# EAGLE design GB-Cartridge-Reader-Writer (EAGLE 9.5.2)
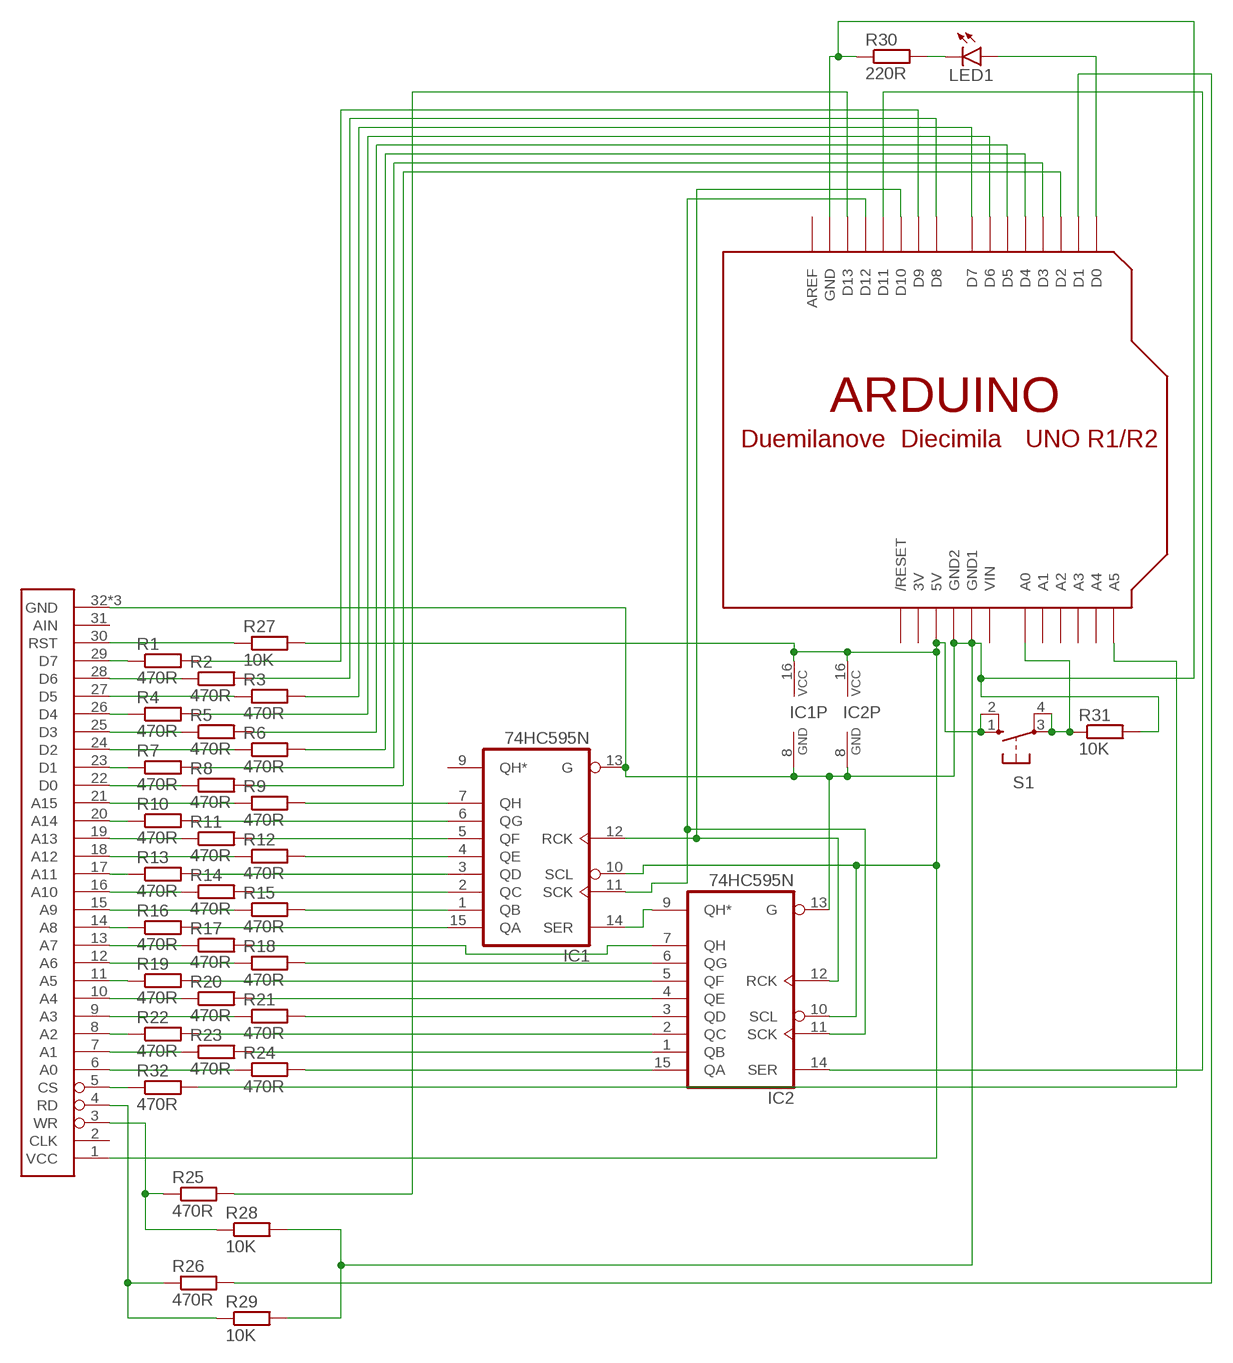
[diagram p0: schematic, sheet 1]

## Parts
IC1  74HC595N  [DIL16]
IC2  74HC595N  [DIL16]
LED1  LED5MM  [LED5MM]
R1  470R  R-EU_0207/10  [0207/10]
R2  470R  R-EU_0207/10  [0207/10]
R3  470R  R-EU_0207/10  [0207/10]
R4  470R  R-EU_0207/10  [0207/10]
R5  470R  R-EU_0207/10  [0207/10]
R6  470R  R-EU_0207/10  [0207/10]
R7  470R  R-EU_0207/10  [0207/10]
R8  470R  R-EU_0207/10  [0207/10]
R9  470R  R-EU_0207/10  [0207/10]
R10  470R  R-EU_0207/10  [0207/10]
R11  470R  R-EU_0207/10  [0207/10]
R12  470R  R-EU_0207/10  [0207/10]
R13  470R  R-EU_0207/10  [0207/10]
R14  470R  R-EU_0207/10  [0207/10]
R15  470R  R-EU_0207/10  [0207/10]
R16  470R  R-EU_0207/10  [0207/10]
R17  470R  R-EU_0207/10  [0207/10]
R18  470R  R-EU_0207/10  [0207/10]
R19  470R  R-EU_0207/10  [0207/10]
R20  470R  R-EU_0207/10  [0207/10]
R21  470R  R-EU_0207/10  [0207/10]
R22  470R  R-EU_0207/10  [0207/10]
R23  470R  R-EU_0207/10  [0207/10]
R24  470R  R-EU_0207/10  [0207/10]
R25  470R  R-EU_0207/10  [0207/10]
R26  470R  R-EU_0207/10  [0207/10]
R27  10K  R-EU_0207/10  [0207/10]
R28  10K  R-EU_0207/10  [0207/10]
R29  10K  R-EU_0207/10  [0207/10]
R30  220R  R-EU_0207/10  [0207/10]
R31  10K  R-EU_0207/10  [0207/10]
R32  470R  R-EU_0207/10  [0207/10]
S1  10-XX  [B3F-10XX]
U$1  ARDUINO-NOHOLE  [ARDUINO-NOHOLE]
U$2  GB-CARTRIDGE-SLOTV3  [GB-CARTRIDGE-SLOT-3]

## Nets
N$1: R1.1 U$2.29(D7)
N$2: R2.1 U$2.28(D6)
N$3: R3.1 U$2.27(D5)
N$4: R4.1 U$2.26(D4)
N$5: R5.1 U$2.25(D3)
N$6: R6.1 U$2.24(D2)
N$7: R7.1 U$2.23(D1)
N$8: R8.1 U$2.22(D0)
N$9: R9.1 U$2.21(A15)
N$10: R10.1 U$2.20(A14)
N$11: R11.1 U$2.19(A13)
N$12: R12.1 U$2.18(A12)
N$13: R13.1 U$2.17(A11)
N$14: R14.1 U$2.16(A10)
N$15: R15.1 U$2.15(A9)
N$16: R16.1 U$2.14(A8)
N$17: R17.1 U$2.13(A7)
N$18: R18.1 U$2.12(A6)
N$19: R19.1 U$2.11(A5)
N$20: R20.1 U$2.10(A4)
N$21: R21.1 U$2.9(A3)
N$22: R22.1 U$2.8(A2)
N$23: R23.1 U$2.7(A1)
N$24: R24.1 U$2.6(A0)
N$25: IC2.15(QA) R24.2
N$26: IC2.1(QB) R23.2
N$27: R32.1 U$2.5(CS)
N$28: IC2.3(QD) R21.2
N$29: IC2.4(QE) R20.2
N$30: IC2.2(QC) R22.2
N$31: IC2.6(QG) R18.2
N$32: IC2.7(QH) R17.2
N$33: IC2.5(QF) R19.2
N$34: IC1.1(QB) R15.2
N$35: IC1.2(QC) R14.2
N$36: IC1.15(QA) R16.2
N$37: IC1.4(QE) R12.2
N$38: IC1.5(QF) R11.2
N$39: IC1.3(QD) R13.2
N$40: IC1.7(QH) R9.2
N$41: R1.2 U$1.D9
N$42: IC1.11(SCK) IC2.11(SCK) U$1.D12
N$43: R27.1 U$2.30(RST)
N$44: R25.1 R28.1 U$2.3(WR)
N$45: R5.2 U$1.D5
N$46: R26.2 U$1.D1
N$47: R7.2 U$1.D3
N$48: R8.2 U$1.D2
N$49: IC1.14(SER) IC2.9(QH*)
N$50: LED1.A U$1.D0
N$51: IC1.10(SCL) IC1.16(VCC) IC2.10(SCL) IC2.16(VCC) R27.2 S1.1(S) S1.2(S1) U$1.5V U$2.1(VCC)
N$52: R6.2 U$1.D4
N$54: R25.2 U$1.D13
N$55: R4.2 U$1.D6
N$56: R3.2 U$1.D7
N$57: R2.2 U$1.D8
N$58: LED1.K(C) R30.2
N$59: IC1.12(RCK) IC2.12(RCK) U$1.D10
N$60: IC1.6(QG) R10.2
N$61: IC2.14(SER) U$1.D11
N$62: IC1.8(GND) IC1.13(G) IC2.8(GND) IC2.13(G) R28.2 R29.2 R30.1 R31.2 U$1.GND U$1.GND1 U$1.GND2 U$2.32(GND) U$2.PAD1(GND) U$2.PAD2(GND)
N$63: R26.1 R29.1 U$2.4(RD)
N$64: R32.2 U$1.A5
N$65: R31.1 S1.3(P) S1.4(P1) U$1.A0
Unconnected: IC1.9(QH*) U$1.A1 U$1.A2 U$1.A3 U$1.A4 U$1.AREF U$1.RESET(/RESET) U$2.2(CLK) U$2.31(AIN)

## Power pins joined to a net without a drawn wire
3V: U$1.3V
VIN: U$1.VIN

## Library data of the parts
IC1 IC2 = 74xx:74*595: 8-bit SHIFT REGISTER, output latch
LED1 = led:LED: LED OSRAM: - CHIPLED LG R971, LG N971, LY N971, LG Q971, LY Q971, LO R971, LY R971 LH N974, LH R974 LS Q976, LO Q976, LY Q976 LO Q996 - Hyper CHIPLED LW Q18S LB Q993, LB Q99A, LB R99A - SideLED LS A670, LO A670, LY A670, LG A670, LP A670 LB A673, LV A673, LT A673, LW A673 LH A674 LY A675 LS A676, LA A676, LO A676, LY A676, LW A676 LS A679, LY A679, LG A679 - Hyper Micro SIDELED® LS Y876, LA Y876, LO Y876, LY Y876 LT Y87S - SmartLED LW L88C, LW L88S LB L89C, LB L89S, LG L890 LS L89K, LO L89K, LY L89K LS L896, LA L896, LO L896, LY L896 - TOPLED LS T670, LO T670, LY T670, LG T670, LP T670 LSG T670, LSP T670, LSY T670, LOP T670, LYG T670 LG T671, LOG T671, LSG T671 LB T673, LV T673, LT T673, LW T673 LH T674 LS T676, LA T676, LO T676, LY T676, LB T676, LH T676, LSB T676, LW T676 LB T67C, LV T67C, LT T67C, LS T67K, LO T67K, LY T67K, LW E67C LS E67B, LA E67B, LO E67B, LY E67B, LB E67C, LV E67C, LT E67C LW T67C LS T679, LY T679, LG T679 LS T770, LO T770, LY T770, LG T770, LP T770 LB T773, LV T773, LT T773, LW T773 LH T774 LS E675, LA E675, LY E675, LS T675 LS T776, LA T776, LO T776, LY T776, LB T776 LHGB T686 LT T68C, LB T68C - Hyper Mini TOPLED® LB M676 - Mini TOPLED Santana® LG M470 LS M47K, LO M47K, LY M47K Source: http://www.osram.convergy.de LUXEON: - LUMILED® LXK2-PW12-R00, LXK2-PW12-S00, LXK2-PW14-U00, LXK2-PW14-V00 LXK2-PM12-R00, LXK2-PM12-S00, LXK2-PM14-U00 LXK2-PE12-Q00, LXK2-PE12-R00, LXK2-PE12-S00, LXK2-PE14-T00, LXK2-PE14-U00 LXK2-PB12-K00, LXK2-PB12-L00, LXK2-PB12-M00, LXK2-PB14-N00, LXK2-PB14-P00, LXK2-PB14-Q00 LXK2-PR12-L00, LXK2-PR12-M00, LXK2-PR14-Q00, LXK2-PR14-R00 LXK2-PD12-Q00, LXK2-PD12-R00, LXK2-PD12-S00 LXK2-PH12-R00, LXK2-PH12-S00 LXK2-PL12-P00, LXK2-PL12-Q00, LXK2-PL12-R00 Source: www.luxeon.com KINGBRIGHT: KA-3528ASYC Source: www.kingbright.com
R1-R32 = rcl:R-EU_: RESISTOR, European symbol; SPICEPREFIX: R
S1 = switch-omron:10-XX: OMRON SWITCH; MPN: B3F-1000; OC_FARNELL: 176432; OC_NEWARK: 36M3542
U$1 = adafruit:ARDUINO: Arduino Diecimila/Duemilanove Make a shield with ease, this package has all the named pins as well as the two mounting drill holes and an outline of the USB and DC power connector. The outline is on the DIMENSION layer, so if your board house uses it they will cut the outline to match. http://www.ladyada.net/library/pcb/eaglelibrary.html
U$2 = jrodrigo-gameboy:GB-CARTRIDGE-SLOT

## Board
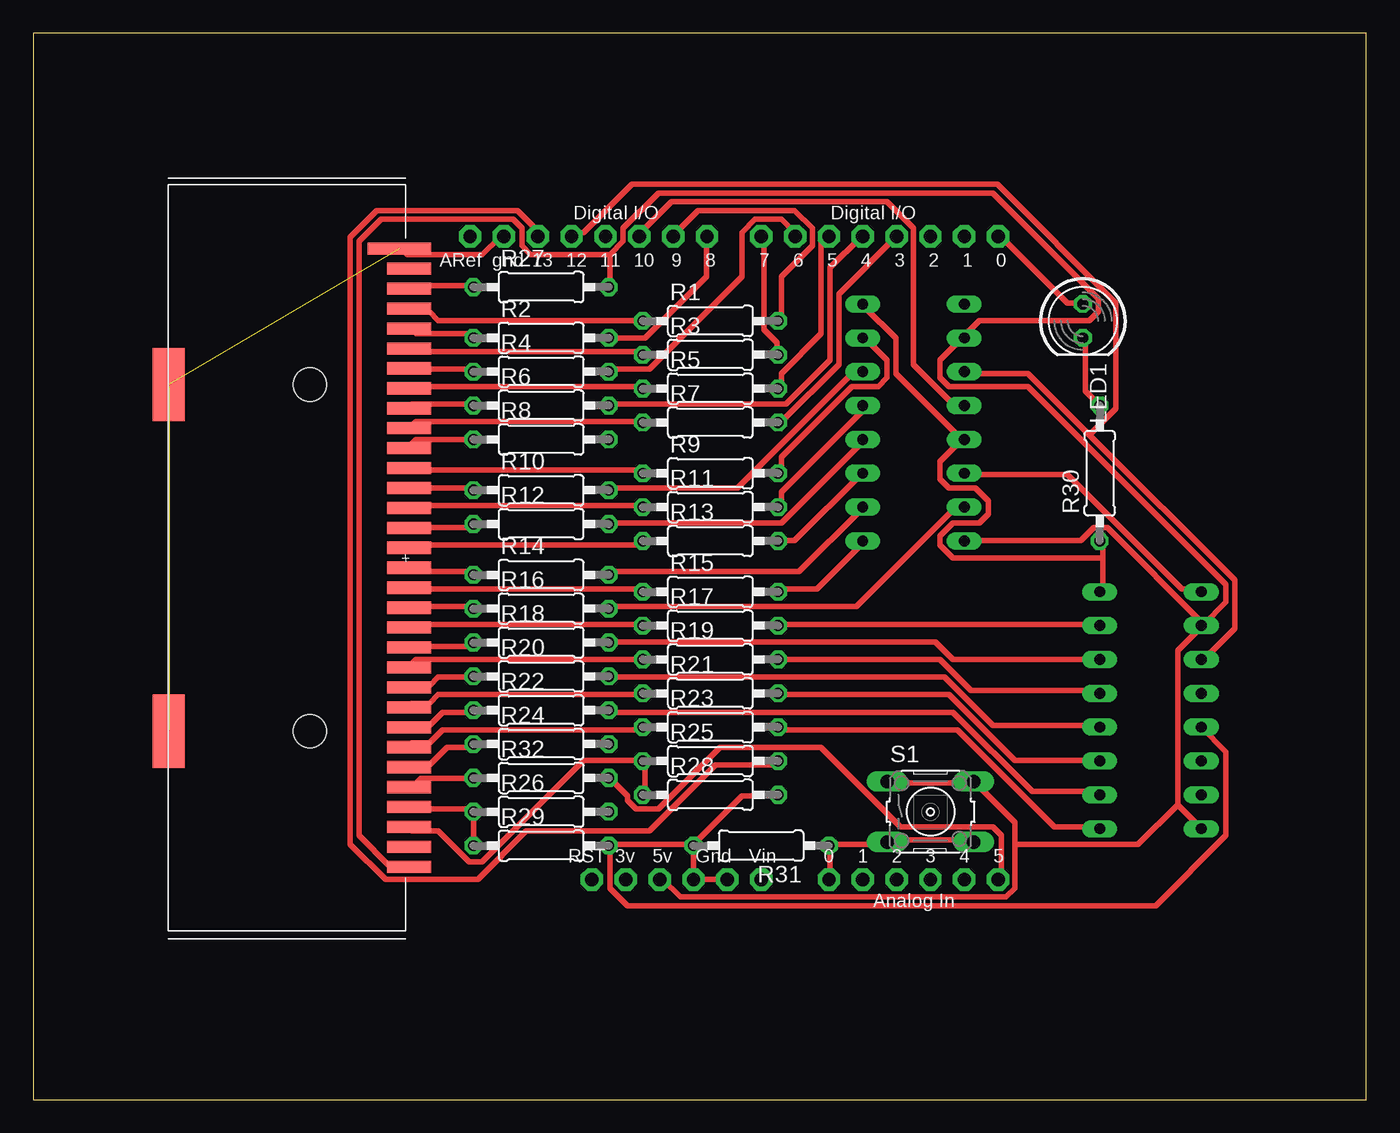
[diagram p1: board, top side]
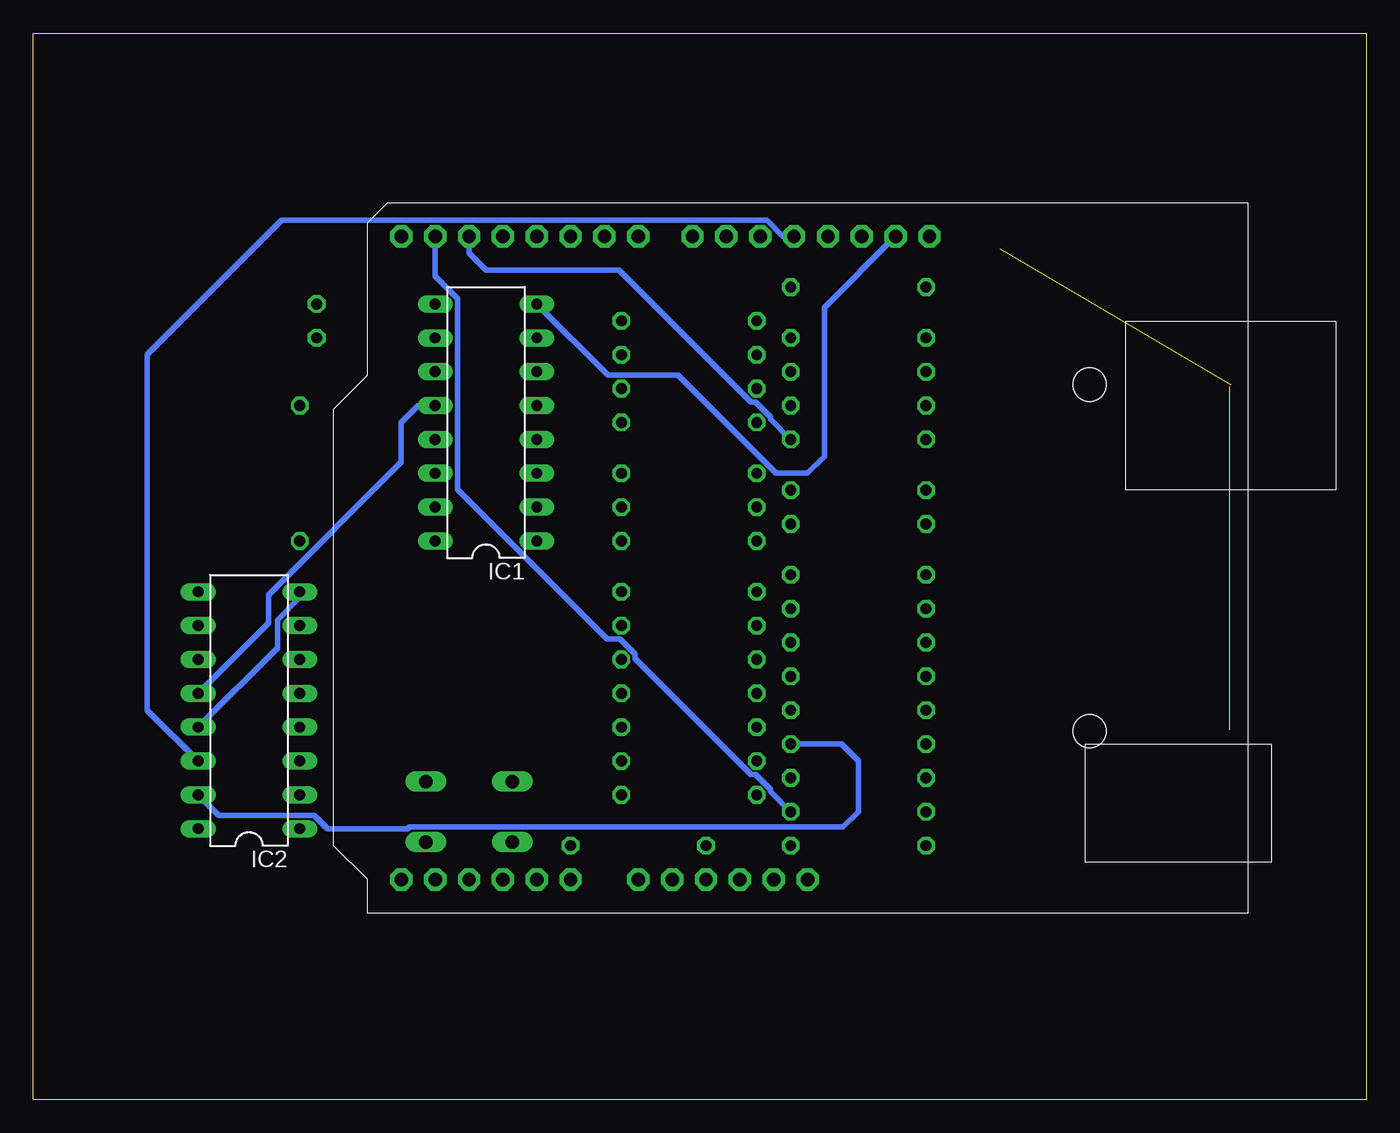
[diagram p2: board, bottom side, seen from below]

Size 100 x 80 mm. Coordinates in mm from the lower left corner, seen from the top.
Outline: 0,0 100,0 100,80 0,80 0,0
Copper layers (1*16): Top 0.035mm / dielectric 1.5mm / Bottom 0.035mm
Design rules "default *": minimum track width 16mil, minimum drill 0.7mm, track to track 10mil, track to pad 6mil, pad to pad 6mil, via to via 6mil, smd to smd 6mil, copper to edge 40mil, drill to drill 6mil, minimum pad ring 10mil, minimum via ring 8mil, stop-mask expansion 4mil, vias tented up to drill 0mil, thermal gap 10mil

### Footprints (pad centres in the part's own frame; a part is rotated, then mirrored left to right if it is on the bottom)
DIL16 = drill 0.813 long: 1 -8.89,-3.81; 2 -6.35,-3.81; 3 -3.81,-3.81; 4 -1.27,-3.81; 5 1.27,-3.81; 6 3.81,-3.81; 7 6.35,-3.81; 8 8.89,-3.81; 9 8.89,3.81; 10 6.35,3.81; 11 3.81,3.81; 12 1.27,3.81; 13 -1.27,3.81; 14 -3.81,3.81; 15 -6.35,3.81; 16 -8.89,3.81
LED5MM = drill 0.813 octagon: A -1.27,0; K 1.27,0
0207/10 = drill 0.813 octagon: 1 -5.08,0; 2 5.08,0
B3F-10XX = drill 1.016 long: 1 -3.251,2.261; 2 3.251,2.261; 3 -3.251,-2.261; 4 3.251,-2.261
ARDUINO-NOHOLE = drill 1 pad 1.676 octagon: 3V 35.56,2.54; 5V 38.1,2.54; A0 50.8,2.54; A1 53.34,2.54; A2 55.88,2.54; A3 58.42,2.54; A4 60.96,2.54; A5 63.5,2.54; AREF 23.876,50.8; D0 63.5,50.8; D1 60.96,50.8; D2 58.42,50.8; D3 55.88,50.8; D4 53.34,50.8; D5 50.8,50.8; D6 48.26,50.8; D7 45.72,50.8; D8 41.656,50.8; D9 39.116,50.8; D10 36.576,50.8; D11 34.036,50.8; D12 31.496,50.8; D13 28.956,50.8; GND 26.416,50.8; GND1 43.18,2.54; GND2 40.64,2.54; RESET 33.02,2.54; VIN 45.72,2.54
GB-CARTRIDGE-SLOT-3 = smd 3.302 x 0.914: 1 -0.27,23.183; 2 -0.27,21.687; 3 -0.27,20.191; 4 -0.27,18.695; 5 -0.27,17.199; 6 -0.27,15.703; 7 -0.27,14.207; 8 -0.27,12.71; 9 -0.27,11.214; 10 -0.27,9.718; 11 -0.27,8.222; 12 -0.27,6.726; 13 -0.27,5.23; 14 -0.27,3.734; 15 -0.27,2.238; 16 -0.27,0.742; 17 -0.27,-0.754; 18 -0.27,-2.25; 19 -0.27,-3.746; 20 -0.27,-5.242; 21 -0.27,-6.738; 22 -0.27,-8.234; 23 -0.27,-9.73; 24 -0.27,-11.226; 25 -0.27,-12.723; 26 -0.27,-14.219; 27 -0.27,-15.715; 28 -0.27,-17.211; 29 -0.27,-18.707; 30 -0.27,-20.203; 31 -0.27,-21.699 | smd 4.762 x 0.914: 32 0.46,-23.195 | smd 2.4 x 5.5: PAD1 17.8,13; PAD2 17.8,-13 | hole 2.5: 7.2,13; 7.2,-13

### Placement (x,y rotation side)
IC1  66.04,50.8 90 bottom
IC2  83.82,29.21 90 bottom
LED1  78.74,58.42 270 top
R1  50.8,58.42 0 top
R2  38.1,57.15 0 top
R3  50.8,55.88 0 top
R4  38.1,54.61 0 top
R5  50.8,53.34 0 top
R6  38.1,52.07 0 top
R7  50.8,50.8 0 top
R8  38.1,49.53 0 top
R9  50.8,46.99 0 top
R10  38.1,45.72 0 top
R11  50.8,44.45 0 top
R12  38.1,43.18 0 top
R13  50.8,41.91 0 top
R14  38.1,39.37 0 top
R15  50.8,38.1 0 top
R16  38.1,36.83 0 top
R17  50.8,35.56 0 top
R18  38.1,34.29 0 top
R19  50.8,33.02 0 top
R20  38.1,31.75 0 top
R21  50.8,30.48 0 top
R22  38.1,29.21 0 top
R23  50.8,27.94 0 top
R24  38.1,26.67 0 top
R25  50.8,25.4 0 top
R26  38.1,21.59 0 top
R27  38.1,60.96 0 top
R28  50.8,22.86 0 top
R29  38.1,19.05 0 top
R30  80.01,46.99 90 top
R31  54.61,19.05 180 top
R32  38.1,24.13 0 top
S1  67.31,21.59 0 top
U$1  8.89,13.97 0 top
U$2  27.94,40.64 180 top

### Tracks (layer width: path | path; a pad name or v marks a point on that pad's centre or on a via)
N$1
  Top 0.406: R1.1 45.57,58.45 30.38,58.45 29.72,59.11 28.4,59.11 U$2.29
N$2
  Top 0.406: R2.1 33.02,57.45 28.73,57.45 28.4,57.78 U$2.28
N$3
  Top 0.406: R3.1 45.57,56.13 28.4,56.13 U$2.27
N$4
  Top 0.406: R4.1 33.02,54.81 28.4,54.81 U$2.26
N$5
  Top 0.406: R5.1 45.57,53.49 28.4,53.49 U$2.25
N$6
  Top 0.406: R6.1 33.02,52.17 28.4,52.17 U$2.24
N$7
  Top 0.406: R7.1 45.57,50.85 28.73,50.85 28.4,50.52 U$2.23
N$8
  Top 0.406: R8.1 28.73,49.53 28.4,49.2 U$2.22
N$9
  Top 0.406: R9.1 45.57,47.22 28.4,47.22 U$2.21
N$10
  Top 0.406: R10.1 33.02,45.9 28.4,45.9 U$2.20
N$11
  Top 0.406: R11.1 45.57,44.58 28.4,44.58 U$2.19
N$12
  Top 0.406: R12.1 33.02,42.93 28.4,42.93 U$2.18
N$13
  Top 0.406: R13.1 45.57,41.6 28.4,41.6 U$2.17
N$14
  Top 0.406: R14.1 33.02,39.62 28.4,39.62 U$2.16
N$15
  Top 0.406: R15.1 45.57,38.3 28.4,38.3 U$2.15
N$16
  Top 0.406: R16.1 33.02,36.98 28.4,36.98 U$2.14
N$17
  Top 0.406: R17.1 45.57,35.66 28.4,35.66 U$2.13
N$18
  Top 0.406: R18.1 33.02,34.01 28.4,34.01 U$2.12
N$19
  Top 0.406: R19.1 28.73,33.02 28.4,32.69 U$2.11
N$20
  Top 0.406: R20.1 33.02,31.7 30.38,31.7 29.72,31.04 28.4,31.04 U$2.10
N$21
  Top 0.406: R21.1 45.57,30.38 30.38,30.38 29.72,29.72 28.4,29.72 U$2.9
N$22
  Top 0.406: R22.1 33.02,29.06 30.71,29.06 29.72,28.07 28.4,28.07 U$2.8
N$23
  Top 0.406: R23.1 45.57,27.74 30.71,27.74 29.72,26.75 28.4,26.75 U$2.7
N$24
  Top 0.406: R24.1 33.02,26.42 31.04,26.42 29.72,25.09 28.4,25.09 U$2.6
N$25
  Bottom 0.406: R24.2 39.37,26.67 38.1,25.4 38.1,21.59 39.24,20.45 71.79,20.45 71.91,20.32 77.91,20.32 78.93,21.34 86.11,21.34 IC2.15
N$26
  Top 0.406: R23.2 56.13,27.74 69.34,27.74 76.61,20.47 79.91,20.47 IC2.1
N$27
  Top 0.406: R32.1 33.02,24.11 29.06,24.11 28.4,23.44 U$2.5
N$28
  Top 0.406: IC2.3 79.91,25.43 73.64,25.43 68.68,30.38 56.13,30.38 R21.2
N$29
  Top 0.406: IC2.4 79.91,28.07 71.98,28.07 68.35,31.7 43.26,31.7 R20.2
N$30
  Top 0.406: IC2.2 79.91,23.11 74.95,23.11 69.01,29.06 43.26,29.06 R22.2
N$31
  Top 0.406: IC2.6 69.01,33.02 67.69,34.34 43.26,34.34 R18.2
N$32
  Top 0.406: R17.2 56.13,35.66 79.91,35.66 IC2.7
N$33
  Top 0.406: R19.2 68.02,33.02 70.33,30.71 79.91,30.71 IC2.5
N$34
  Top 0.406: R15.2 56.13,38.3 58.78,38.3 62.08,41.6 IC1.1
N$35
  Top 0.406: R14.2 43.26,39.62 57.45,39.62 62.08,44.25 IC1.2
N$36
  Top 0.406: R16.2 43.26,36.98 61.75,36.98 69.01,44.25 69.67,44.25 IC1.15
N$37
  Top 0.406: R12.2 43.26,43.26 56.13,43.26 62.41,49.53 IC1.4
N$38
  Top 0.406: R11.2 56.13,44.58 56.13,45.57 62.41,51.84 IC1.5
N$39
  Top 0.406: R13.2 56.13,41.94 57.12,41.94 62.08,46.89 IC1.3
N$40
  Top 0.406: R9.2 56.13,47.22 56.13,48.21 61.42,53.49 63.4,53.49 64.06,54.15 64.06,55.47 62.41,57.12 IC1.7
N$41
  Top 0.406: R1.2 56.13,58.45 56.13,61.75 58.45,64.06 58.45,65.38 57.12,66.7 49.86,66.7 48.21,65.05 U$1.D9
N$42
  Top 0.406: 79.25,49.86 74.62,54.48 70,54.48 IC1.11 | 79.25,49.86 90.14,38.96 90.14,35.33 87.83,33.02 IC2.11 | 79.25,49.86 81.23,51.84 81.23,59.77 72.31,68.68 44.91,68.68 41.27,65.05 40.62,65.05 U$1.D12
N$43
  Top 0.406: R27.1 33.02,61.09 28.4,61.09 U$2.30
N$44
  Top 0.406: R28.1 45.9,23.11 45.9,25.09 R25.1 45.57,25.43 41.27,25.43 33.68,17.83 32.69,17.83 30.38,20.14 28.4,20.14 U$2.3
N$45
  Top 0.406: R5.2 56.13,53.49 56.13,54.48 59.11,57.45 59.11,64.39 59.44,64.72 U$1.D5
N$46
  Bottom 0.406: R26.2 44.7,23.11 44.7,23.28 45.81,24.38 46.14,24.38 54.86,33.11 54.86,33.44 55.97,34.54 56.96,34.54 68.17,45.76 68.17,60.11 69.85,61.79 U$1.D1
N$47
  Top 0.406: U$1.D3 60.43,60.43 60.43,55.14 56.13,50.85 R7.2
N$48
  Bottom 0.406: R8.2 44.7,51.05 44.7,51.22 45.81,52.32 46.14,52.32 56.05,62.23 66.04,62.23 67.31,63.5 U$1.D2
N$49
  Top 0.406: IC2.9 87.5,38.3 86.18,38.3 77.6,46.89 70,46.89 IC1.14
N$50
  Top 0.406: LED1.A 78.59,59.77 77.6,59.77 72.64,64.72 U$1.D0
N$51
  Top 0.406: S1.1 64.06,23.77 70.33,23.77 S1.2 70.66,23.77 73.64,20.8 73.64,19.15 | 73.64,19.15 73.64,15.85 72.97,15.19 48.54,15.19 47.22,16.51 U$1.5V | 85.85,22.12 87.5,20.47 IC2.16 | 85.85,22.12 85.85,33.68 87.5,35.33 IC2.10 87.83,35.66 | 87.83,35.66 80.57,42.93 79.58,42.93 78.59,41.94 70,41.94 IC1.16 | 73.64,19.15 82.88,19.15 85.85,22.12 | 43.26,63.4 43.26,61.09 R27.2 | 43.26,63.4 44.25,64.39 44.25,65.38 46.89,68.02 71.98,68.02 79.91,60.1 79.91,59.11 79.25,58.45 70.99,58.45 70,57.45 IC1.10 69.67,57.12 68.02,55.47 68.02,54.15 68.68,53.49 74.62,53.49 89.48,38.63 89.48,37.31 87.83,35.66 | 43.26,63.4 37.31,63.4 36.65,64.06 36.65,65.38 35.99,66.04 26.09,66.04 24.43,64.39 24.43,19.81 26.75,17.5 28.07,17.5 U$2.1
N$52
  Top 0.406: R6.2 43.26,52.17 56.46,52.17 59.77,55.47 59.77,62.41 62.08,64.72 U$1.D4
N$54
  Top 0.406: R25.2 55.8,25.09 51.18,25.09 46.23,20.14 36.98,20.14 33.35,16.51 26.42,16.51 23.77,19.15 23.77,64.72 25.76,66.7 36.32,66.7 37.97,65.05 U$1.D13
N$55
  Top 0.406: R4.2 43.26,54.81 46.23,54.81 53.16,61.75 53.16,65.05 54.15,66.04 56.13,66.04 57.12,65.05 U$1.D6
N$56
  Top 0.406: R3.2 55.8,56.13 55.8,56.79 54.81,57.78 54.81,64.72 U$1.D7
N$57
  Top 0.406: R2.2 43.26,57.12 45.9,57.12 50.52,61.75 50.52,64.72 U$1.D8
N$58
  Top 0.406: R30.2 78.92,53.16 78.92,57.12 LED1.K
N$59
  Top 0.406: IC1.12 69.67,52.17 69.01,52.17 66.04,55.14 66.04,65.38 64.06,67.36 47.88,67.36 45.57,65.05 U$1.D10
  Bottom 0.406: IC2.12 82.35,35.76 82.35,37.86 72.39,47.82 72.39,50.8 71.12,52.07 IC1.12
N$60
  Top 0.406: R10.2 43.26,45.9 52.83,45.9 61.42,54.48 62.08,54.48 IC1.6
N$61
  Bottom 0.406: U$1.D11 43.78,64.77 44.97,65.96 81.36,65.96 91.44,55.88 91.44,29.21 IC2.14
N$62  (2 unrouted)
  Top 0.406: 10.24,27.74 U$2.PAD1 10.24,27.41 | 10.24,53.49 U$2.PAD2 | 49.53,19.15 43.26,19.15 R29.2 43.26,18.82 43.26,15.85 44.58,14.53 84.2,14.53 89.48,19.81 89.48,26.09 IC2.13 | 49.53,19.15 53.16,22.78 55.8,22.78 R28.2 | 49.53,19.15 R31.2 U$1.GND2 U$1.GND1 | 80.24,40.62 80.24,41.6 R30.1 | 80.24,40.62 80.24,38.3 IC2.8 | 69.67,49.53 64.72,54.48 64.72,57.12 62.41,59.44 IC1.8 | 80.24,40.62 69.01,40.62 68.02,41.6 68.02,42.27 69.01,43.26 70.99,43.26 71.65,43.92 71.65,44.91 70.66,45.9 68.68,45.9 68.02,46.56 68.02,47.88 69.67,49.53 | 69.67,49.53 IC1.13 | U$1.GND 35,64.72 33.68,63.4 28.07,63.4 27.74,63.73 U$2.32
  Bottom 0.406: IC2.13 81.69,33.88 81.69,35.98 80.01,37.66 IC2.8 | U$1.GND 40.64,59.44 40.64,48.26 41.91,46.99 44.28,46.99 51.65,54.36 56.9,54.36 IC1.8
N$63
  Top 0.406: R29.1 R26.1 33.02,21.79 28.4,21.79 U$2.4
N$64
  Top 0.406: R32.2 43.26,24.11 44.58,22.78 44.58,22.45 45.24,21.79 46.89,21.79 51.51,26.42 59.11,26.42 65.05,20.47 71.98,20.47 72.64,19.81 72.64,16.51 U$1.A5
N$65
  Top 0.406: U$1.A0 59.77,16.51 59.77,18.82 R31.1 59.77,19.15 64.06,19.15 S1.3 64.06,19.48 70.33,19.48 S1.4